# Altium schematic sheet PUMP.SchDoc
size A4; SheetNumber: 5; SheetTotal: 6
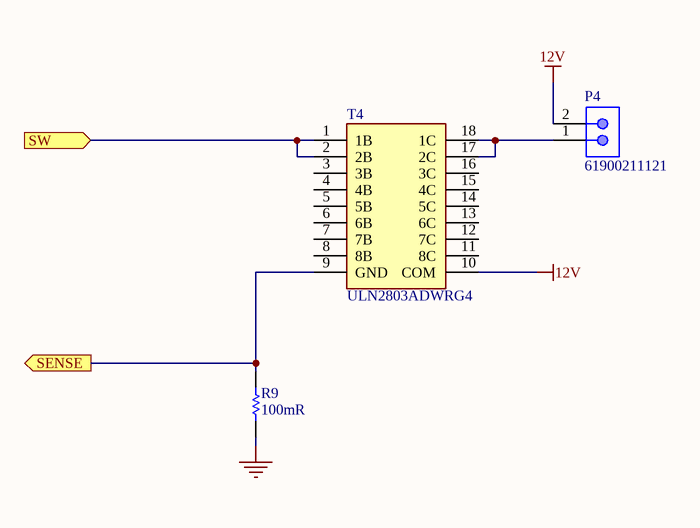
[diagram p0: PUMP.SchDoc]

## Parts
P4  61900211121  [61900211121]
R9  value 100mR  [RES_1206_H060 (_IPC_MD)]  (hidden comment: 100mR 1% 0,25W 200V 1206)
T4  ULN2803ADWRG4  [SOIC127P1030X265-18N]

## Ports
SENSE (out), SW (in)

## Nets
12V: P4.2 T4.10(COM)
GND: R9.1
SENSE: R9.2 T4.9(GND) ; port SENSE
SW: T4.1(1B) T4.2(2B) ; port SW
NetP4_1: P4.1 T4.17(2C) T4.18(1C)

Not connected (* = marked no-connect by the designer): T4 3(3B) 4(4B) 5(5B) 6(6B) 7(7B) 8(8B) 11(8C) 12(7C) 13(6C) 14(5C) 15(4C) 16(3C)

## Library data of the parts
P4 = 61900211121: WR-WTB THT Male Vertical Locking Header, pitch 2.54mm, 2p; Pin Number: 2; Contact Resistance: 20mOhm; Rated Current: 3A; Withstanding Voltage: 1000VAC; Working Voltage: 250VAC; ComponentLink1Description: Manufacturer; ComponentLink1URL: http://www.we-online.de; ComponentLink2Description: Datasheet; ComponentLink2URL: https://www.we-online.com/catalog/datasheet/61900211121.pdf; Pitch: 2.54mm; Published Date: January 2020; Publisher: Wurth Elektronik; Mounting Technology: THT; Packaging: Bag; Operating Temperature: -40 to +105degC; Part Number: 61900211121; Gender: Male; Type: Vertical
R9 = RES100mR1%1206: Designator: R; PCB Lib: MUAB_RES.PcbLib; Scm Lib: Discrete.SchLib; Watt: 0,25W; Tol: 1%; Part Number: RES100mR1%1206; Type: Standard; Volt: 200V; Qty: 1; Supplier 1: Arrow; Supplier 2: Avnet; Supplier 3: Digi-Key; Supplier 4: Distrelec; Supplier 5: Farnell; Supplier 6: Future Electronics; Supplier 7: Mouser; Supplier 8: RSComponents; Supplier 9: Rutronik; Supplier 10: SEED OPL
T4 = ULN2803ADWRG4: Darlington; Manufacturer_Name: Texas Instruments; Datasheet Link: http://www.ti.com/lit/ds/symlink/uln2803a.pdf; Height: 2.65mm; Manufacturer_Part_Number: ULN2803ADWRG4; Mouser Part Number: 595-ULN2803ADWRG4; Mouser Price/Stock: https://www.mouser.co.uk/ProductDetail/Texas-Instruments/ULN2803ADWRG4?qs=pbofycSusePr3zMQZfJ%2FRA%3D%3D; Arrow Part Number: ULN2803ADWRG4; Arrow Price/Stock: https://www.arrow.com/en/products/uln2803adwrg4/texas-instruments; Supplier 1: Mouser; Supplier Part Number 1: 595-ULN2803ADWRG4